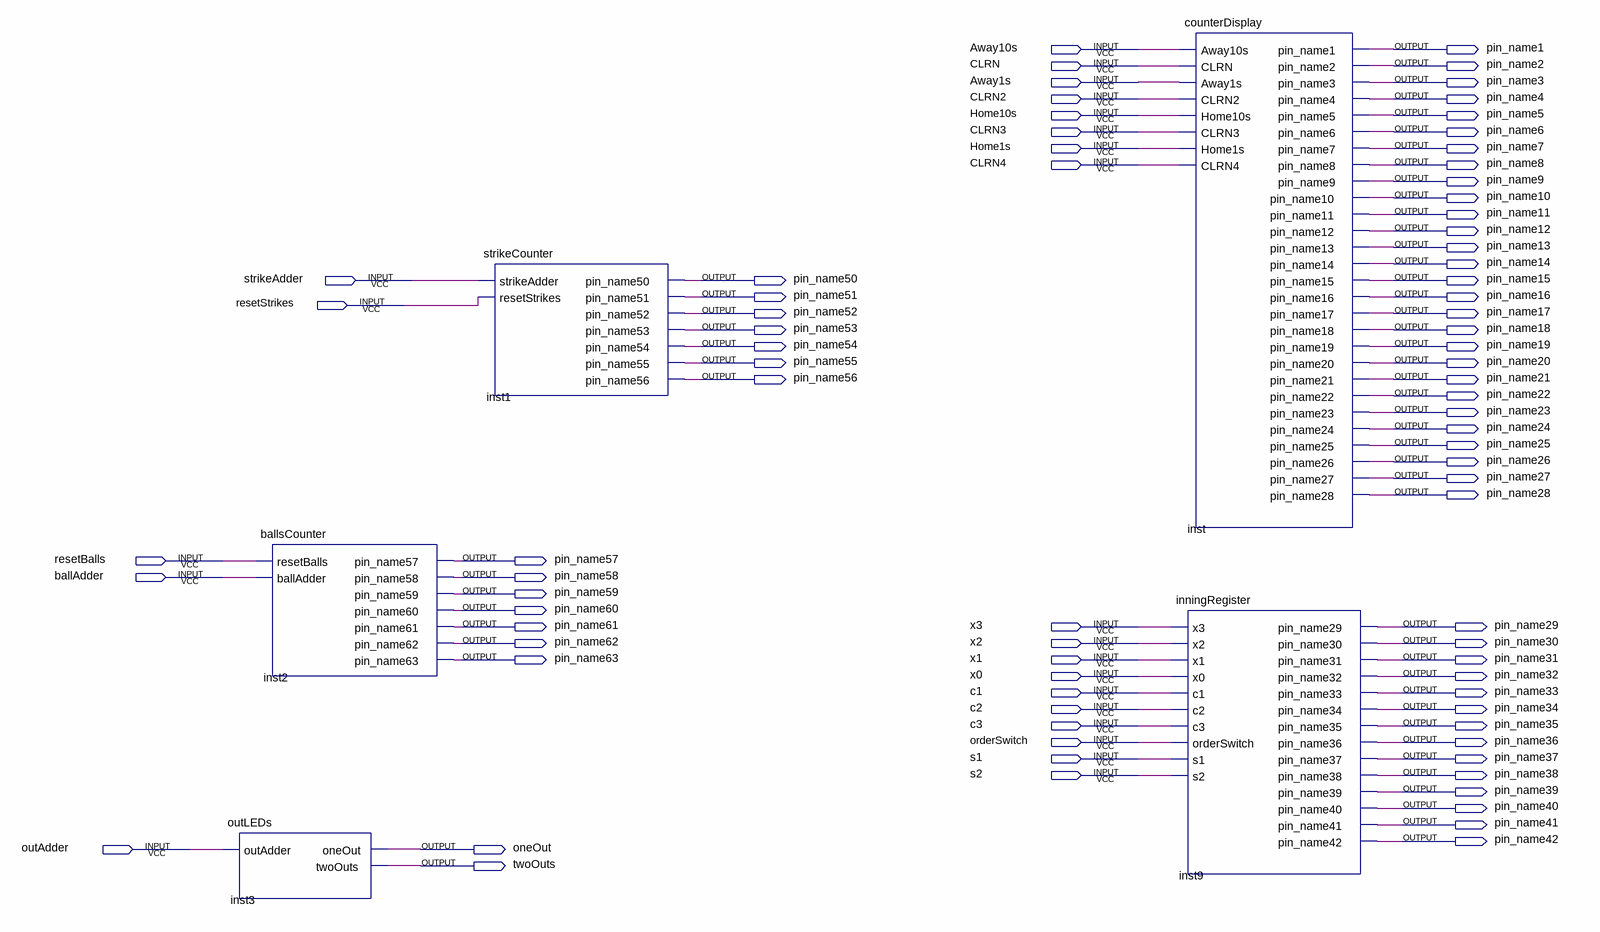
[diagram p0: schematic sheet]
// Quartus schematic BaseballScoreboard.bdf as structural Verilog: 5 symbols, 81 pins
module BaseballScoreboard (
  input  Away10s,
  input  CLRN,
  input  Away1s,
  input  CLRN2,
  input  Home10s,
  input  CLRN3,
  input  Home1s,
  input  CLRN4,
  input  strikeAdder,
  input  resetStrikes,
  input  resetBalls,
  input  ballAdder,
  input  x3,
  input  x2,
  input  x1,
  input  x0,
  input  c1,
  input  c2,
  input  c3,
  input  orderSwitch,
  input  s1,
  input  s2,
  input  outAdder,
  output pin_name1,
  output pin_name2,
  output pin_name3,
  output pin_name4,
  output pin_name5,
  output pin_name6,
  output pin_name7,
  output pin_name8,
  output pin_name9,
  output pin_name10,
  output pin_name11,
  output pin_name12,
  output pin_name13,
  output pin_name14,
  output pin_name50,
  output pin_name15,
  output pin_name51,
  output pin_name16,
  output pin_name52,
  output pin_name17,
  output pin_name53,
  output pin_name18,
  output pin_name54,
  output pin_name19,
  output pin_name55,
  output pin_name20,
  output pin_name56,
  output pin_name21,
  output pin_name22,
  output pin_name23,
  output pin_name24,
  output pin_name25,
  output pin_name26,
  output pin_name27,
  output pin_name28,
  output pin_name57,
  output pin_name58,
  output pin_name59,
  output pin_name60,
  output pin_name61,
  output pin_name29,
  output pin_name62,
  output pin_name30,
  output pin_name63,
  output pin_name31,
  output pin_name32,
  output pin_name33,
  output pin_name34,
  output pin_name35,
  output pin_name36,
  output pin_name37,
  output pin_name38,
  output pin_name39,
  output pin_name40,
  output pin_name41,
  output pin_name42,
  output oneOut,
  output twoOuts
);

  outLEDs inst3 (.outAdder(outAdder), .oneOut(oneOut), .twoOuts(twoOuts));
  ballsCounter inst2 (
    .resetBalls(resetBalls), .ballAdder(ballAdder), .pin_name57(pin_name57), .pin_name58(pin_name58),
    .pin_name59(pin_name59), .pin_name60(pin_name60), .pin_name61(pin_name61), .pin_name62(pin_name62),
    .pin_name63(pin_name63));
  strikeCounter inst1 (
    .strikeAdder(strikeAdder), .resetStrikes(resetStrikes), .pin_name50(pin_name50), .pin_name51(pin_name51),
    .pin_name52(pin_name52), .pin_name53(pin_name53), .pin_name54(pin_name54), .pin_name55(pin_name55),
    .pin_name56(pin_name56));
  inningRegister inst9 (
    .x3(x3), .x2(x2), .x1(x1), .x0(x0), .c1(c1), .c2(c2), .c3(c3), .orderSwitch(orderSwitch), .s1(s1),
    .s2(s2), .pin_name29(pin_name29), .pin_name30(pin_name30), .pin_name31(pin_name31),
    .pin_name32(pin_name32), .pin_name33(pin_name33), .pin_name34(pin_name34), .pin_name35(pin_name35),
    .pin_name36(pin_name36), .pin_name37(pin_name37), .pin_name38(pin_name38), .pin_name39(pin_name39),
    .pin_name40(pin_name40), .pin_name41(pin_name41), .pin_name42(pin_name42));
  counterDisplay inst (
    .Away10s(Away10s), .CLRN(CLRN), .Away1s(Away1s), .CLRN2(CLRN2), .Home10s(Home10s), .CLRN3(CLRN3),
    .Home1s(Home1s), .CLRN4(CLRN4), .pin_name1(pin_name1), .pin_name2(pin_name2), .pin_name3(pin_name3),
    .pin_name4(pin_name4), .pin_name5(pin_name5), .pin_name6(pin_name6), .pin_name7(pin_name7),
    .pin_name8(pin_name8), .pin_name9(pin_name9), .pin_name10(pin_name10), .pin_name11(pin_name11),
    .pin_name12(pin_name12), .pin_name13(pin_name13), .pin_name14(pin_name14), .pin_name15(pin_name15),
    .pin_name16(pin_name16), .pin_name17(pin_name17), .pin_name18(pin_name18), .pin_name19(pin_name19),
    .pin_name20(pin_name20), .pin_name21(pin_name21), .pin_name22(pin_name22), .pin_name23(pin_name23),
    .pin_name24(pin_name24), .pin_name25(pin_name25), .pin_name26(pin_name26), .pin_name27(pin_name27),
    .pin_name28(pin_name28));
endmodule
